# Altium project EPS-LKAS Manipulator.PrjPcb
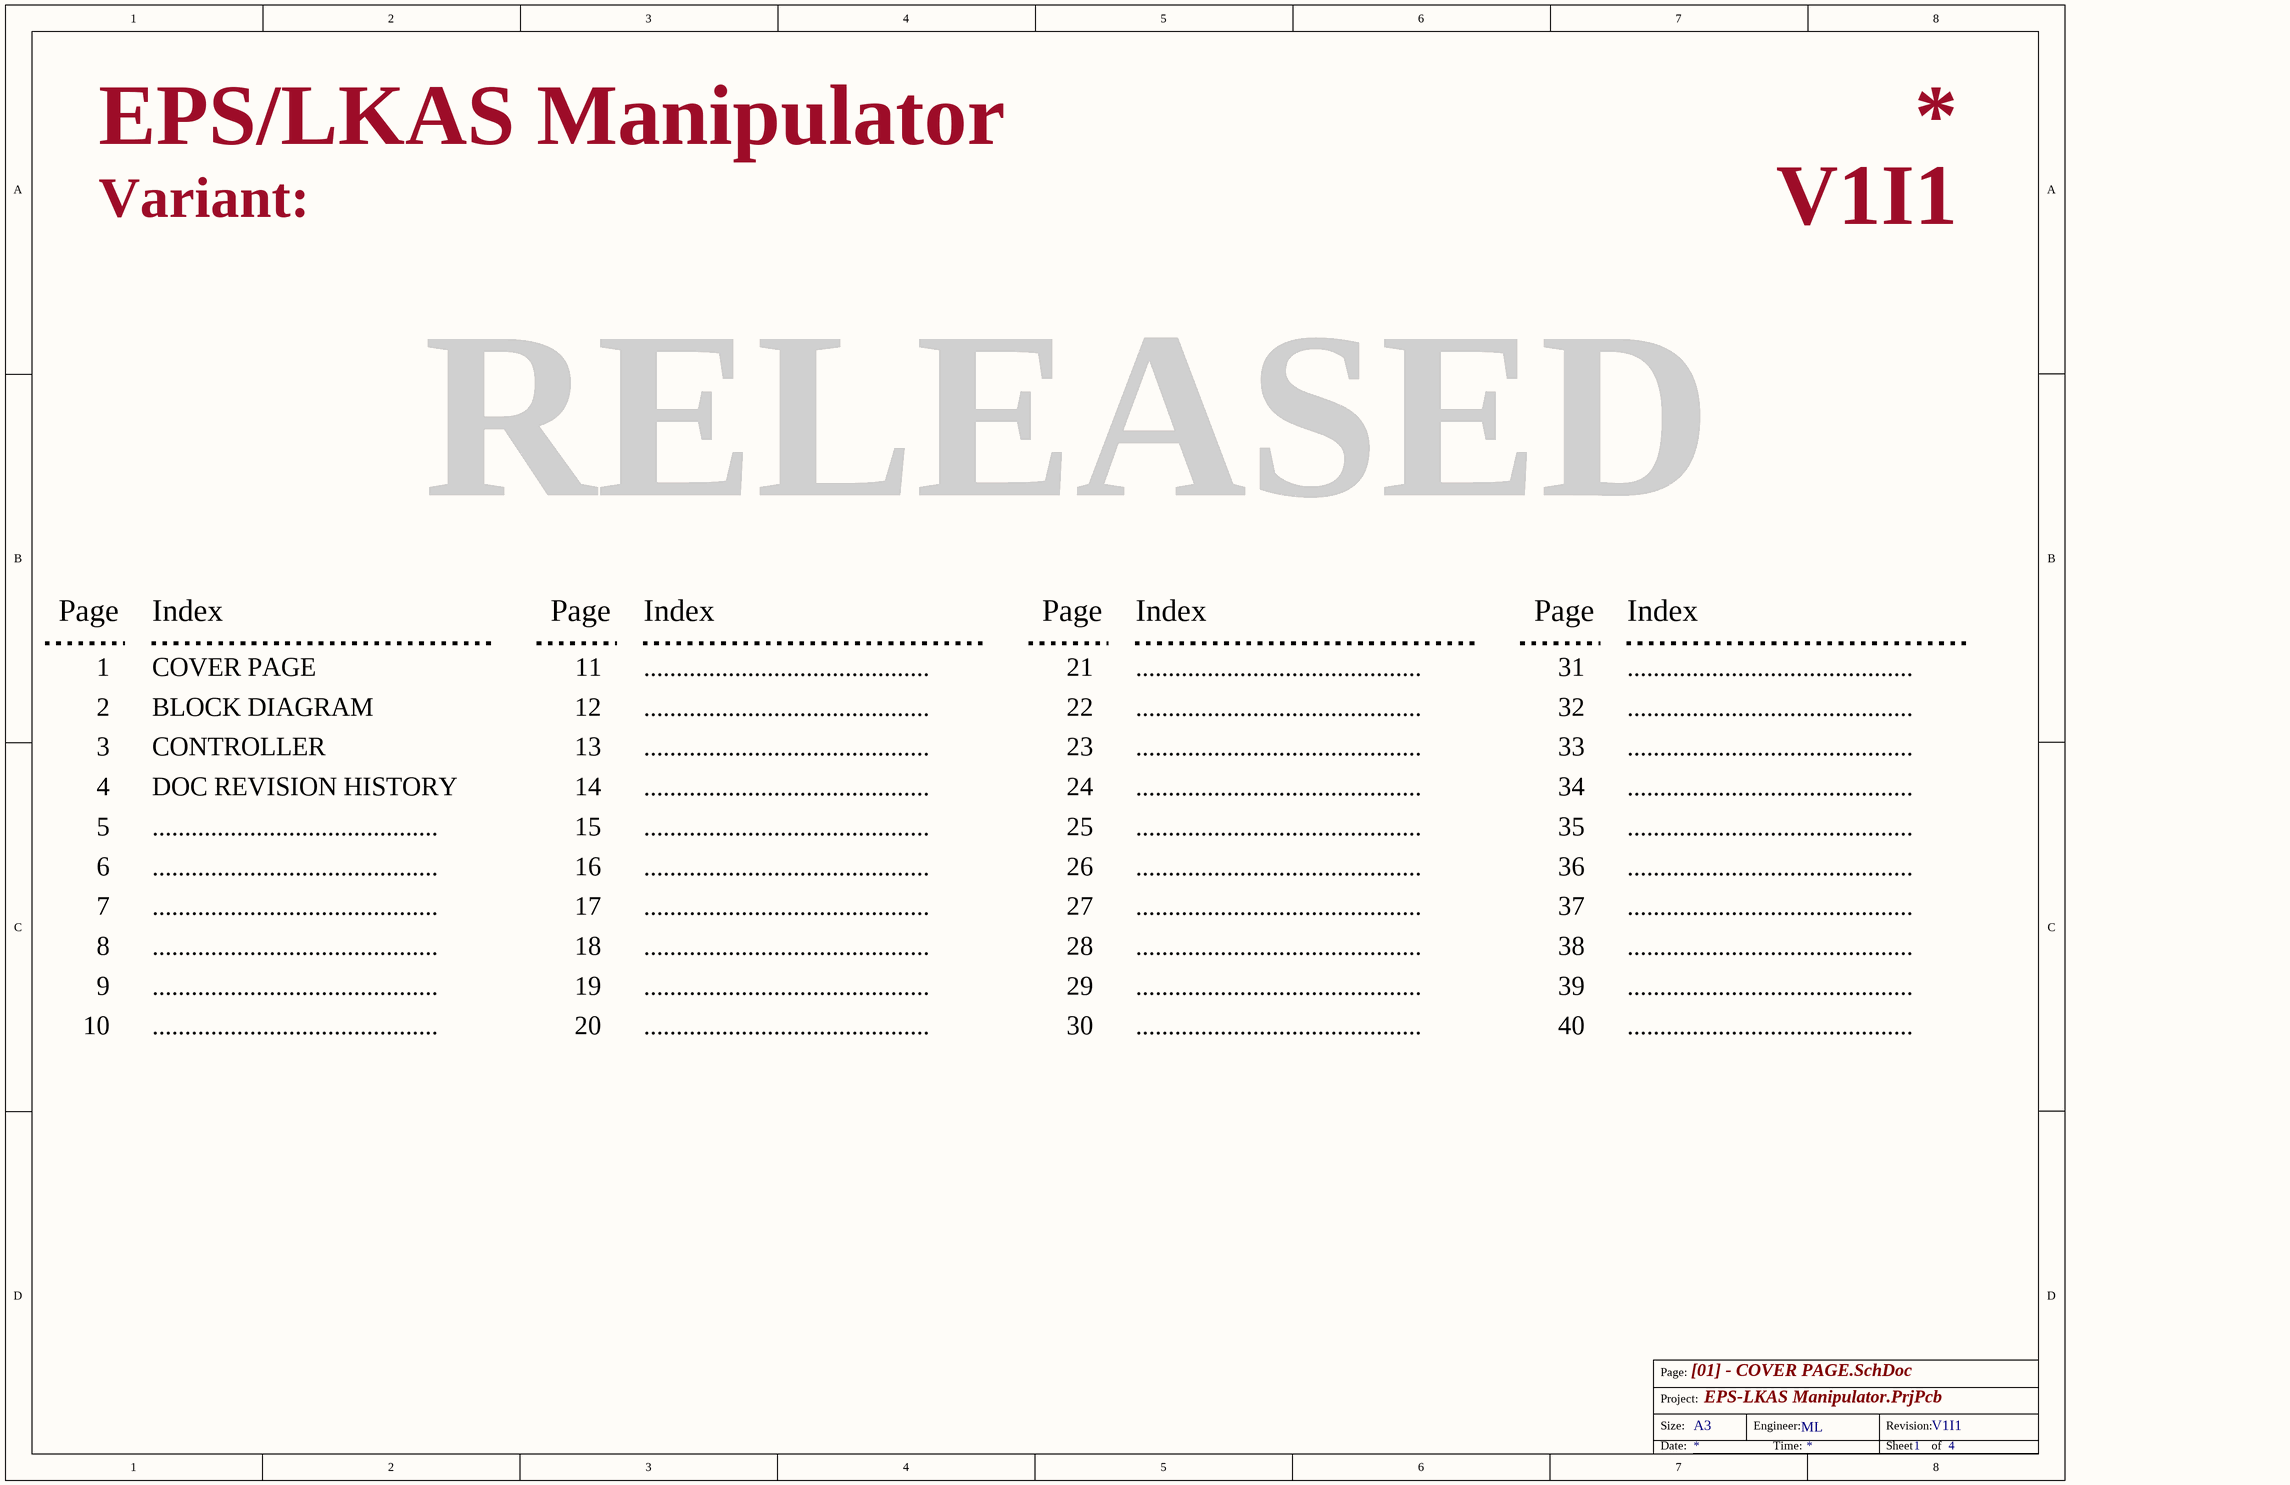
[diagram p0: [01] - COVER PAGE.SchDoc]
Company: Independant; Project: EPS/LKAS Manipulator; VersionRevision: V1I1
4 sheets, 37 parts. Net scope: global (net labels, ports and power ports of the same name join across sheets).
Board file: LKAS-EPS_PCB_V1I1.PcbDoc
Sheets:
  [01] - COVER PAGE.SchDoc
  [02] - BLOCK DIAGRAM.SchDoc
  [03] - CONTROLLER.SchDoc
  [04] - DOC REVISION HISTORY.SchDoc

## Sheet [01] - COVER PAGE.SchDoc
size A3; DocumentNumber: 1; SheetNumber: 1; SheetTotal: 4; Organization: Altium Limited; Address1: L3, 12a Rodborough Rd; Address2: Frenchs Forest; Address3: NSW; Address4: Australia 2086

### Notes on the sheet
- Variant:
- RELEASED
- Page
- Index
- 1
- COVER PAGE
- 11
- ............................................
- 21
- 31
- 2
- 3
- BLOCK DIAGRAM
- CONTROLLER
- 12
- 13
- 22
- 23
- 32
- 33
- 4
- 5
- DOC REVISION HISTORY
- 14
- 15
- 24
- 25
- 34
- 35
- 6
- 16
- 26
- 36
- 7
- 8
- 17
- 18
- 27
- 28
- 37
- 38
- 9
- 10
- 19
- 20
- 29
- 30
- 39
- 40
- Page:
- Size:
- Project:
- A3
- Engineer:
- ML
- Revision:
- Date:
- Time:
- Sheet
- of

## Sheet [02] - BLOCK DIAGRAM.SchDoc
size A3; DocumentNumber: 2; SheetNumber: 2; SheetTotal: 4; Organization: Altium Limited; Address1: L3, 12a Rodborough Rd; Address2: Frenchs Forest; Address3: NSW; Address4: Australia 2086
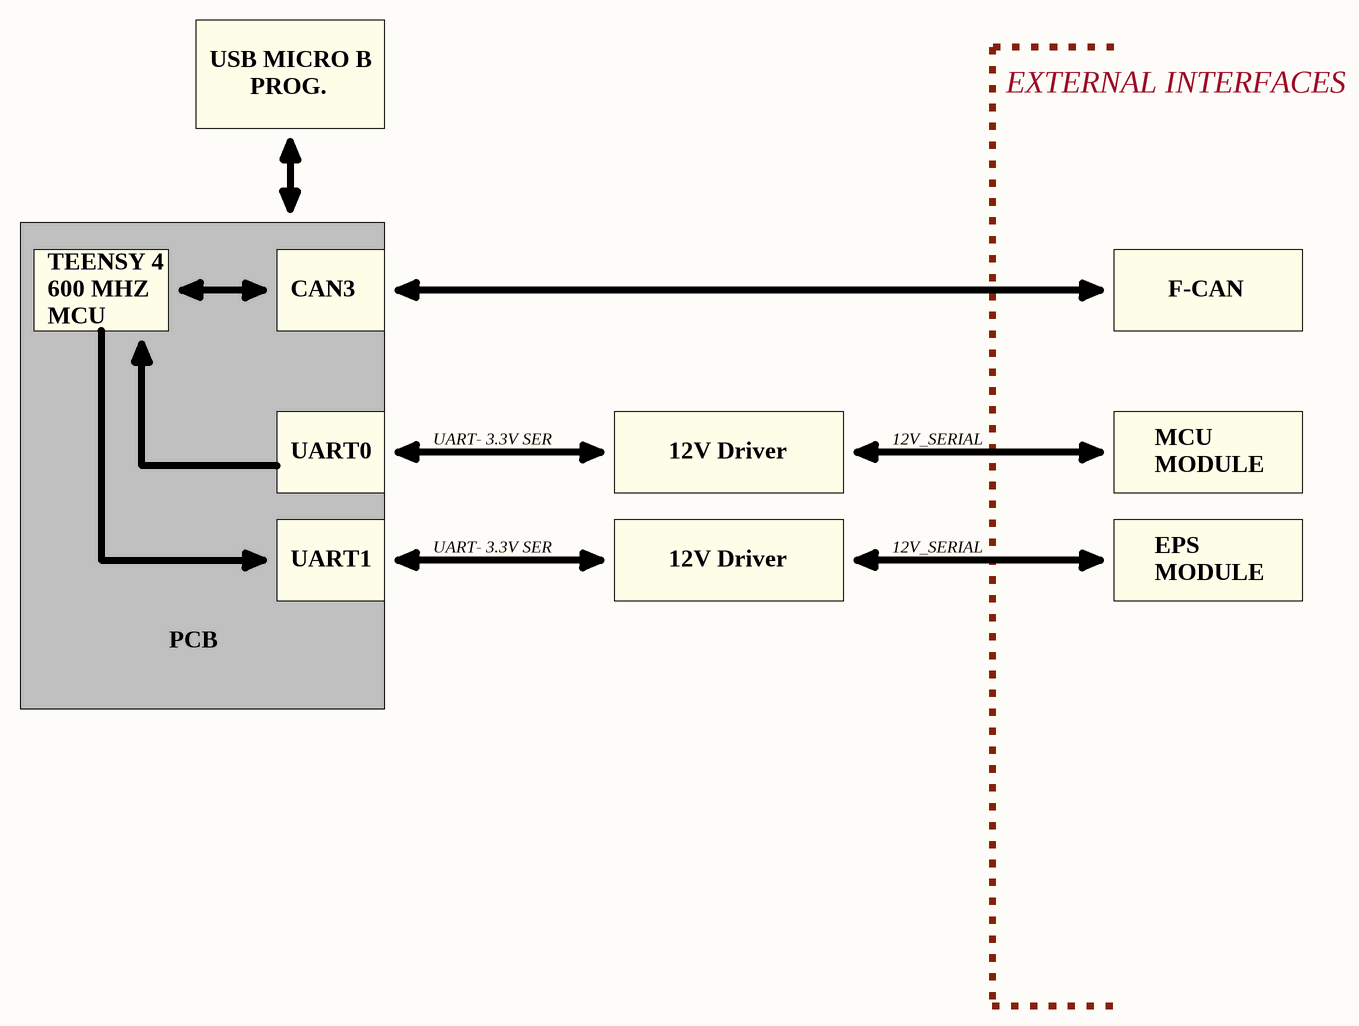
[diagram p1: [02] - BLOCK DIAGRAM.SchDoc]

### Notes on the sheet
- USB MICRO B
- PROG.
- EXTERNAL INTERFACES
- TEENSY 4
- 600 MHZ
- MCU
- CAN3
- F-CAN
- UART0
- UART- 3.3V SER
- 12V Driver
- 12V_SERIAL
- MODULE
- UART1
- Serial
- EPS
- PCB
- Page:
- Size:
- Project:
- A3
- Engineer:
- ML
- Revision:
- Date:
- Time:
- Sheet
- of

## Sheet [03] - CONTROLLER.SchDoc
size A3; DocumentNumber: 3; SheetNumber: 3; SheetTotal: 4; Organization: Altium Limited; Address1: L3, 12a Rodborough Rd; Address2: Frenchs Forest; Address3: NSW; Address4: Australia 2086
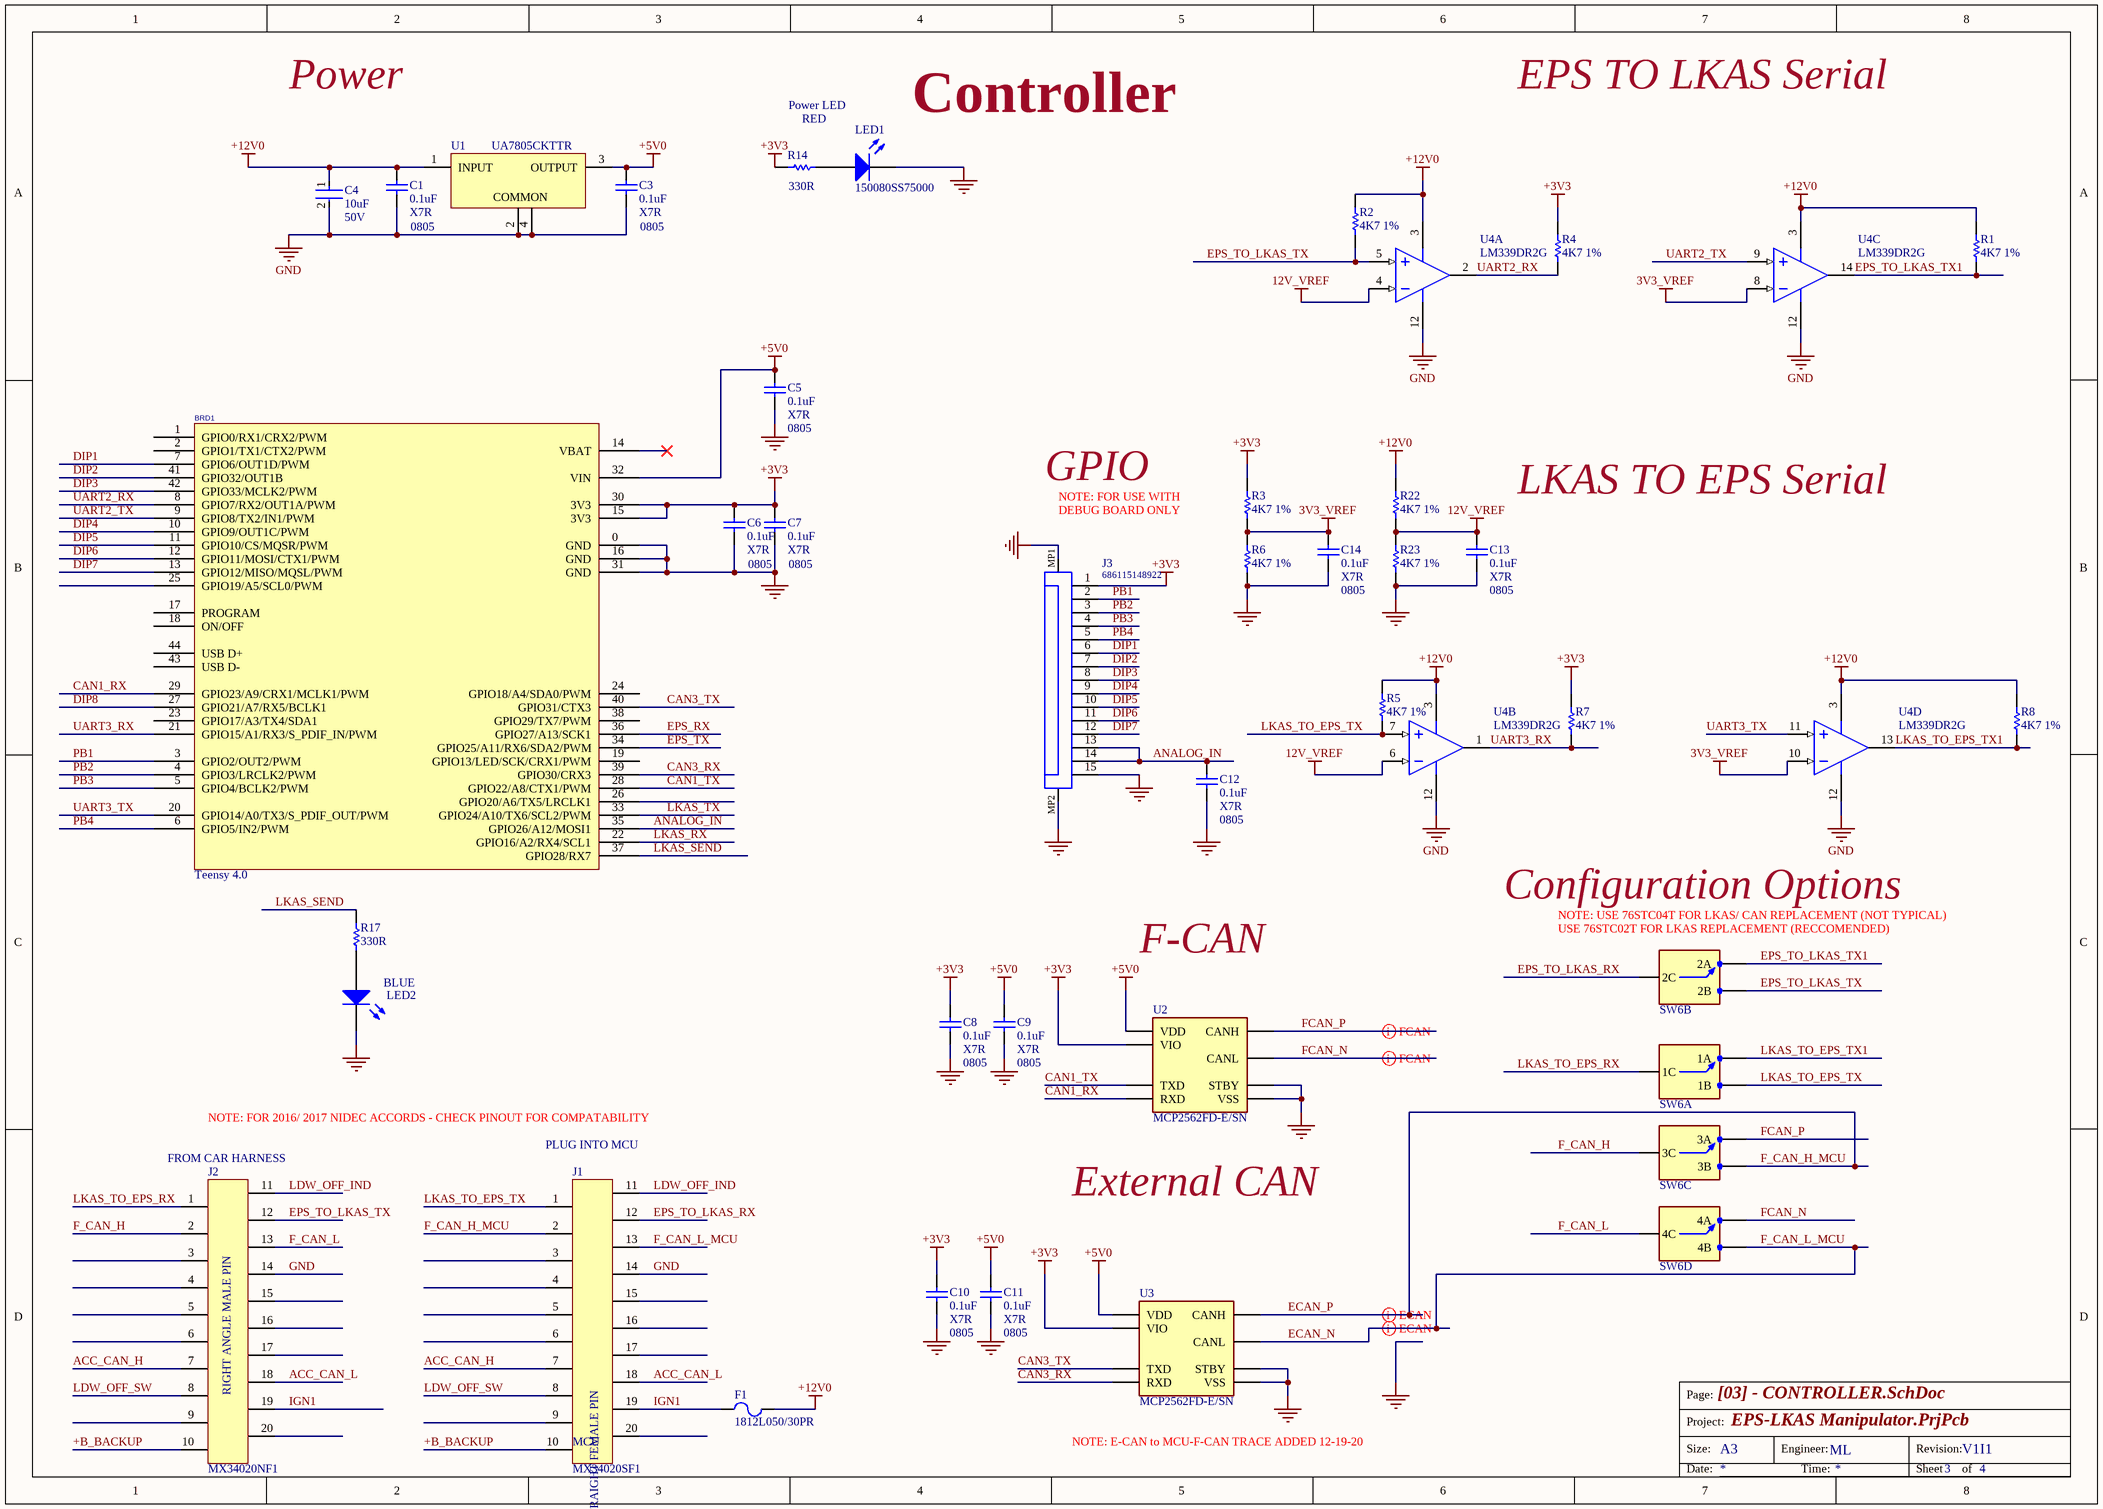
[diagram p2: [03] - CONTROLLER.SchDoc]

### Parts
BRD1  Teensy 4.0  [tEENSY 4.0]
C1  0.1uF  Dielectric: X7R  Case Code (Imperial): 0805  [C0805]
C3  0.1uF  Dielectric: X7R  Case Code (Imperial): 0805  [C0805]
C4  value 10uF  Voltage: 50V  [FP-CL31-IPC_C]  (hidden comment: CL31A106KBHNNNE)
C5  0.1uF  Dielectric: X7R  Case Code (Imperial): 0805  [C0805]
C6  0.1uF  Dielectric: X7R  Case Code (Imperial): 0805  [C0805]
C7  0.1uF  Dielectric: X7R  Case Code (Imperial): 0805  [C0805]
C8  0.1uF  Dielectric: X7R  Case Code (Imperial): 0805  [C0805]
C9  0.1uF  Dielectric: X7R  Case Code (Imperial): 0805  [C0805]
C10  0.1uF  Dielectric: X7R  Case Code (Imperial): 0805  [C0805]
C11  0.1uF  Dielectric: X7R  Case Code (Imperial): 0805  [C0805]
C12  0.1uF  Dielectric: X7R  Case Code (Imperial): 0805  [C0805]
C13  0.1uF  Dielectric: X7R  Case Code (Imperial): 0805  [C0805]
C14  0.1uF  Dielectric: X7R  Case Code (Imperial): 0805  [C0805]
F1  1812L050/30PR  [LFUS-1812L05030PR_V]
J1  MX34020SF1  [MX34020SF1]
J2  MX34020NF1  [MX34020NF1]
J3  686115148922  [686115148922]
LED1  150080SS75000  [0805_A]
LED2  150080BS75000  [0805_A]  (value not drawn)
R1  4K7 1%  [RESC0603(1608)_N]
R2  4K7 1%  [RESC0603(1608)_N]
R3  4K7 1%  [RESC0603(1608)_N]
R4  4K7 1%  [RESC0603(1608)_N]
R5  4K7 1%  [RESC0603(1608)_N]
R6  4K7 1%  [RESC0603(1608)_N]
R7  4K7 1%  [RESC0603(1608)_N]
R8  4K7 1%  [RESC0603(1608)_N]
R14  value 330R  [RESC2013X50X30NL20T20]  (hidden comment: CRCW0805330RFKEA)
R17  value 330R  [RESC2013X50X30NL20T20]  (hidden comment: CRCW0805330RFKEA)
R22  4K7 1%  [RESC0603(1608)_N]
R23  4K7 1%  [RESC0603(1608)_N]
SW6  76STC04T  [76STC04T]  (value not drawn)  (parts A,B,C,D of 4)
U1  UA7805CKTTR  [KTT0003A_V]
U2  MCP2562FD-E/SN  [MCP2561]
U3  MCP2562FD-E/SN  [MCP2561]
U4  LM339DR2G  [ONSC-SOIC-14-751A-03_V]  (parts A,B,C,D of 4)

### Nets
3V3_VREF: C14.2 R3.1 R6.2 U4.8(IN3-) U4.10(IN4-)
12V_VREF: C13.2 R22.1 R23.2 U4.4(IN1-) U4.6(IN2-)
+3V3: BRD1.15(3V3) BRD1.30(3V3) C6.2 C7.2 C8.2 C10.2 J3.1 R3.2 R4.2 R7.2 R14.1 U2.5(VIO) U3.5(VIO)
+5V0: BRD1.32(VIN) C3.2 C5.2 C9.2 C11.2 U1.3(OUTPUT) U2.3(VDD) U3.3(VDD)
+12V0: C1.2 C4.1 F1.2 R1.2 R2.2 R5.2 R8.2 R22.2 U1.1(INPUT) U4.3(VCC)
GND: BRD1.0(GND) BRD1.16(GND) BRD1.31(GND) C1.1 C3.1 C4.2 C5.1 C6.1 C7.1 C8.1 C9.1 C10.1 C11.1 C12.1 C13.1 C14.1 J1.14 J2.14 J3.15 J3.MP1 J3.MP2 LED1.1(K) LED2.1(K) R6.1 R23.1 U1.2(COMMON) U1.4(COMMON) U2.2(VSS) U2.8(STBY) U3.2(VSS) U3.8(STBY) U4.12(GND)
+B_BACKUP: J1.10 J2.10
ACC_CAN_H: J1.7 J2.7
ACC_CAN_L: J1.18 J2.18
ANALOG_IN: BRD1.35(GPIO26/A12/MOSI1) C12.2 J3.13 J3.14
CAN1_RX: BRD1.29(GPIO23/A9/CRX1/MCLK1/PWM) U2.4(RXD)
CAN1_TX: BRD1.28(GPIO22/A8/CTX1/PWM) U2.1(TXD)
CAN3_RX: BRD1.39(GPIO30/CRX3) U3.4(RXD)
CAN3_TX: BRD1.40(GPIO31/CTX3) U3.1(TXD)
DIP1: BRD1.7(GPIO6/OUT1D/PWM) J3.6
DIP2: BRD1.41(GPIO32/OUT1B) J3.7
DIP3: BRD1.42(GPIO33/MCLK2/PWM) J3.8
DIP4: BRD1.10(GPIO9/OUT1C/PWM) J3.9
DIP5: BRD1.11(GPIO10/CS/MQSR/PWM) J3.10
DIP6: BRD1.12(GPIO11/MOSI/CTX1/PWM) J3.11
DIP7: BRD1.13(GPIO12/MISO/MQSL/PWM) J3.12
DIP8: BRD1.27(GPIO21/A7/RX5/BCLK1)
ECAN_N: J1.13 SW6.4B U3.6(CANL)  [also labelled F_CAN_L_MCU]
ECAN_P: J1.2 SW6.3B U3.7(CANH)  [also labelled F_CAN_H_MCU]
EPS_RX: BRD1.36(GPIO27/A13/SCK1)
EPS_TO_LKAS_RX: J1.12 SW6.C2(2C)
EPS_TO_LKAS_TX: J2.12 R2.1 SW6.2B U4.5(IN1+)
EPS_TO_LKAS_TX1: R1.1 SW6.2A U4.14(OUT3)
EPS_TX: BRD1.34(GPIO25/A11/RX6/SDA2/PWM)
F_CAN_H: J2.2 SW6.C3(3C)
F_CAN_L: J2.13 SW6.C4(4C)
FCAN_N: SW6.4A U2.6(CANL)
FCAN_P: SW6.3A U2.7(CANH)
IGN1: F1.1 J1.19 J2.19
LDW_OFF_IND: J1.11 J2.11
LDW_OFF_SW: J1.8 J2.8
LKAS_RX: BRD1.22(GPIO16/A2/RX4/SCL1)
LKAS_SEND: BRD1.37(GPIO28/RX7) R17.2
LKAS_TO_EPS_RX: J2.1 SW6.C1(1C)
LKAS_TO_EPS_TX: J1.1 R5.1 SW6.1B U4.7(IN2+)
LKAS_TO_EPS_TX1: R8.1 SW6.1A U4.13(OUT4)
LKAS_TX: BRD1.33(GPIO24/A10/TX6/SCL2/PWM)
PB1: BRD1.3(GPIO2/OUT2/PWM) J3.2
PB2: BRD1.4(GPIO3/LRCLK2/PWM) J3.3
PB3: BRD1.5(GPIO4/BCLK2/PWM) J3.4
PB4: BRD1.6(GPIO5/IN2/PWM) J3.5
UART2_RX: BRD1.8(GPIO7/RX2/OUT1A/PWM) R4.1 U4.2(OUT1)
UART2_TX: BRD1.9(GPIO8/TX2/IN1/PWM) U4.9(IN3+)
UART3_RX: BRD1.21(GPIO15/A1/RX3/S_PDIF_IN/PWM) R7.1 U4.1(OUT2)
UART3_TX: BRD1.20(GPIO14/A0/TX3/S_PDIF_OUT/PWM) U4.11(IN4+)
NetLED1_2: LED1.2(A) R14.2
NetLED2_2: LED2.2(A) R17.1

Not connected (* = marked no-connect by the designer): BRD1 1(GPIO0/RX1/CRX2/PWM) 2(GPIO1/TX1/CTX2/PWM) 14(VBAT)* 17(PROGRAM) 18(ON/OFF) 19(GPIO13/LED/SCK/CRX1/PWM) 23(GPIO17/A3/TX4/SDA1) 24(GPIO18/A4/SDA0/PWM) 25(GPIO19/A5/SCL0/PWM) 26(GPIO20/A6/TX5/LRCLK1) 38(GPIO29/TX7/PWM) 43(USB_D-) 44(USB_D+); J1 3 4 5 6 9 15 16 17 20; J2 3 4 5 6 9 15 16 17 20

### Layout directives
differential pair: ECAN_N, ECAN_P, FCAN_N, FCAN_P

### Notes on the sheet
- Power
- Power LED
- EPS TO LKAS Serial
- RED
- (near LED1) Controller
- GPIO
- NOTE: FOR USE WITH
- DEBUG BOARD ONLY
- LKAS TO EPS Serial
- Configuration Options
- (near SW6) NOTE: USE 76STC04T FOR LKAS/ CAN REPLACEMENT (NOT TYPICAL)
- BLUE
- F-CAN
- (near SW6) USE 76STC02T FOR LKAS REPLACEMENT (RECCOMENDED)
- NOTE: FOR 2016/ 2017 NIDEC ACCORDS - CHECK PINOUT FOR COMPATABILITY
- (near J2) FROM CAR HARNESS
- (near J1) PLUG INTO MCU
- External CAN
- (near J1) MCU
- NOTE: E-CAN to MCU-F-CAN TRACE ADDED 12-19-20
- Page:
- Size:
- Project:
- A3
- Engineer:
- ML
- Revision:
- Date:
- Time:
- Sheet
- of
- (in symbol MX34020NF1) RIGHT ANGLE MALE PIN
- (in symbol MX34020SF1) STRAIGHT FEMALE PIN

### Library data of the parts
C1 C3 C5-C14 = CL21B104KCFWPNE: CAP CER 0.1UF 100V X7R 0805; Manufacturer: Samsung; Capacitance: 100nF; Tolerance: 10%; Supplier 1: Digi-Key; Manufacturer Part Number: CL21B104KCFWPNE; Stock 1: 283289; Pricing 1: 1=0.16000, 10=0.11200, 100=0.05250, 500=0.03684, 1000=0.03050 (USD); RoHS: Yes; Mount: Surface Mount; Case/Package: 0805; Case Code (Metric): 2012; Min Operating Temperature: -55°C; Max Operating Temperature: 125°C; Packaging: Tape and Reel; Features: Soft Termination; Length: 0.079inch; Width: 0.049inch; Thickness: 0.053inch; Ratings: AEC-Q200; ComponentLink1URL: http://www.samsungsem.com/servlet/FileDownload?type=spec&file=CL21B104KCFWPNE.pdf&src-supplier=Avnet; ComponentLink1Description: http://www.samsungsem.com/servlet/FileDownload?type=spec&file=CL21B104KCFWPNE.pdf&src-supplier=Avnet; ComponentLink2URL: http://www.samsungsem.com/kr/support/product-search/mlcc/CL21B104KCFWPNE.jsp?src-supplier=Digi-Key; ComponentLink2Description: http://www.samsungsem.com/kr/support/product-search/mlcc/CL21B104KCFWPNE.jsp?src-supplier=Digi-Key; Supplier Part Number 1: 1276-6733-1-ND; Voltage Rating: 100V
C4 = CMP-13271-000016-1: CAP CER 10UF 50V X5R 1206; Manufacturer: Samsung; Tolerance: 10%; Material: Ceramic; Temperature Coefficient: 15%; RoHS: TRUE; Ipc Land Pattern Name: CAPC320160X160; Temperature Range Low: -55°C; Device Class L3: Ceramic Capacitors; Category: Cap; Temperature Characteristic: X5R; Lead Free: Yes; Device Class L2: Capacitors; Octopart: https://octopart.com/cl31a106kbhnnne-samsung-19832778; ComponentLink2Description: Datasheet; Digikey Description: CAP CER 10UF 50V X5R 1206; ComponentLink2URL: http://www.samsungsem.com/kr/support/product-search/mlcc/__icsFiles/afieldfile/2018/06/21/CL31A106KBHNNNE.pdf; Capacitance: 10uF; Manufacturer Part Number: CL31A106KBHNNNE; Temperature Range High: +85°C; Device Class L1: Passive Components; Height: 1.8mm; Automotive: No; Voltage Rating: 50V; Package: CL31; Temperature: -55°C to +85°C
F1 = CMP-2000-05508-1: PTC Resettable Fuse, 0.8 W, 30 V, -40 to 85 degC, 2-Pin SMD, RoHS, Tape and Reel; Manufacturer: Littelfuse-Inc.; Voltage - Max: 30V; Current - Hold (Ih) (Max): 500mA; Time to Trip: 0.15s; Current - Max: 100A; R Min/Max: 0.150~1.000Ohm; Current - Trip (It): 1A; Package Reference: 1812; Family: PTCResettableFuses; Packaging: Tape&Reel(TR); Package / Case: 1812(4532Metric),Concave; Series: POLY-FUSE®,1812L; Mounting Technology: SurfaceMount; Datasheet Version: 02/2016; Datasheet URL: http://www.littelfuse.com/~/media/electronics/datasheets/resettable_ptcs/littelfuse_ptc_1812l_datasheet.pdf.pdf; Manufacturer URL: http://www.littelfuse.com/; Category: CircuitProtection; Package Description: 2-Pin Surface Mount Device, Body 4.55 x 3.24 mm
J1 = MX34020SF1: Automotive Connectors Sckt HOUSING 20P; Manufacturer: JAE Electronics; Number of Positions: 20; Connector Type: Receptacle,Socket,Rectangular; Gender: Female; Current Rating: 3A; Pitch: 0.087inch; Row Spacing: 0.118inch; Supplier 1: Digi-Key; Manufacturer Part Number: MX34020SF1; RoHS: Yes; Category: Connectors; Stock 1: 3393; Pricing 1: 1=0.73000, 10=0.63800, 25=0.60000, 50=0.57500, 100=0.55000, 250=0.50000, 576=0.45000, 1152=0.40000, 2880=0.36250 (USD); Mount: Free Hanging,Cable; Color: Grey; Contact Plating: Tin; Contact Material: Copper Alloy,Copper; Housing Material: PPE; Min Operating Temperature: -40°C; Max Operating Temperature: 85°C; Termination: Crimp; Packaging: Tray; Package Quantity: 192; Number of Contacts: 20; Number of Rows: 2; Height: 14mm; Depth: 21.3mm; Width: 25.1mm; ComponentLink1URL: https://datasheet.ciiva.com/11742/0900766b80fc15d5-11742077.pdf?src-supplier=RSComponents; ComponentLink1Description: https://datasheet.ciiva.com/11742/0900766b80fc15d5-11742077.pdf?src-supplier=RSComponents; ComponentLink2URL: https://datasheet.ciiva.com/4553/sj038752-64597-4553699.pdf?src-supplier=Mouser; ComponentLink2Description: https://datasheet.ciiva.com/4553/sj038752-64597-4553699.pdf?src-supplier=Mouser; ComponentLink3URL: https://datasheet.ciiva.com/6739/614004-6739335.pdf?src-supplier=Newark; ComponentLink3Description: https://datasheet.ciiva.com/6739/614004-6739335.pdf?src-supplier=Newark; ComponentLink4URL: https://datasheet.ciiva.com/762/transportation-pg-v2-2-762885.pdf?src-supplier=Digi-Key; ComponentLink4Description: https://datasheet.ciiva.com/762/transportation-pg-v2-2-762885.pdf?src-supplier=Digi-Key; ComponentLink5URL: https://datasheet.ciiva.com/5821/1009688-5821398.pdf?src-supplier=Farnell; ComponentLink5Description: https://datasheet.ciiva.com/5821/1009688-5821398.pdf?src-supplier=Farnell; ComponentLink6URL: https://datasheet.ciiva.com/7648/1009712-7648886.pdf?src-supplier=Element14; ComponentLink6Description: https://datasheet.ciiva.com/7648/1009712-7648886.pdf?src-supplier=Element14; Supplier Part Number 1: 670-2925-ND
J2 = MX34020NF1: JAE MX34 Series, 2.2mm Pitch 20 Way 2 Row Right Angle PCB Header, Solder Termination, 3A; Manufacturer: JAE Electronics; Connector Type: Male Pin,Rectangular; Gender: Male; Number of Positions: 20; Pitch: 0.087inch; Row Spacing: 0.118inch; Supplier 1: Digi-Key; Manufacturer Part Number: MX34020NF1; RoHS: Yes; Category: Connectors; Stock 1: 10297; Pricing 1: 1=1.57000, 10=1.42100, 100=1.21800, 500=1.01500, 1000=0.87000, 5000=0.77140, 10000=0.75400 (USD); Mount: Through Hole; Contact Material: Brass; Contact Plating: Tin; Color: Grey; Number of Rows: 2; Package Quantity: 288; Packaging: Rail/Tube; Current Rating: 3A; Termination: Solder; Orientation: Right Angle; Number of Contacts: 20; Contact Mating Length: 0.303inch; REACH SVHC: No SVHC; ComponentLink1URL: https://datasheet.ciiva.com/7621/1009688-7621584.pdf?src-supplier=Element14; ComponentLink1Description: https://datasheet.ciiva.com/7621/1009688-7621584.pdf?src-supplier=Element14; ComponentLink2URL: https://datasheet.ciiva.com/4554/sj038751-3818-4554108.pdf?src-supplier=Mouser; ComponentLink2Description: https://datasheet.ciiva.com/4554/sj038751-3818-4554108.pdf?src-supplier=Mouser; ComponentLink3URL: https://datasheet.ciiva.com/11754/0900766b80ddc6f0-11754159.pdf?src-supplier=RSComponents; ComponentLink3Description: https://datasheet.ciiva.com/11754/0900766b80ddc6f0-11754159.pdf?src-supplier=RSComponents; ComponentLink4URL: https://datasheet.ciiva.com/732/transportation-pg-v2-2-732931.pdf?src-supplier=Digi-Key; ComponentLink4Description: https://datasheet.ciiva.com/732/transportation-pg-v2-2-732931.pdf?src-supplier=Digi-Key; Supplier Part Number 1: 670-2924-ND
J3 = CMP-1502-01518-1: SMT ZIF Connectors Hinge Type WR-FPC, Horizontal, Bottom Contact, pitch 1 mm, 15 pins; Manufacturer: Wurth Elektronik; Withstanding Voltage: 500VAC; Contact Resistance: 50mOhm; Pitch: 1mm; Rated Current: 1A; Working Voltage: 100VAC; Pin Number: 15; Publisher: WurthElektronik; Part Number: 686115148922; Packaging: TapeandReel; Operating Temperature: -40to105degC; Contact Design: BottomContact; Manufacturer URL: http://www.we-online.de; Mounting Technology: SMT; Orientation: Horizontal; Package Reference: 686115148922; Datasheet URL: https://katalog.we-online.de/em/datasheet/686115148922.pdf
LED1 = CMP-1426-00010-1: SMD mono-color Chip LED, WL-SMCW, Super Red; Manufacturer: Wuerth Elektronik; PackageReference: 0805_A; ComponentLink2URL: http://katalog.we-online.com/led/datasheet/150080SS75000.pdf; ComponentLink1URL: http://www.we-online.com; Color: Super Red; ComponentLink2Description: Datasheet; ComponentLink1Description: Manufacturer URL; PartNumber: 150080SS75000
LED2 = CMP-1426-00008-1: SMD mono-color Chip LED, WL-SMCW, Blue; Manufacturer: Wuerth Elektronik; Color: Blue; ComponentLink2URL: http://katalog.we-online.com/led/datasheet/150080BS75000.pdf; ComponentLink1URL: http://www.we-online.com; ComponentLink2Description: Datasheet; PackageReference: 0805_A; ComponentLink1Description: Manufacturer URL; PartNumber: 150080BS75000
R1-R8 R22 R23 = CMP-1012-00586-1: 4K7 0.1W 1% 0603 (1608 Metric)  SMD; Case-EIA: 0603; Case-Metric: 1608; Value: 4700.00 Ohm; Power: 0.1 W; Tolerance: 1 %; Technology: SMT
R14 R17 = CMP-2001-03823-1: Manufacturer: Vishay Dale; Part Number: CRCW0805330RFKEA
SW6 = 76STC04T: SWITCH TOGGLE DIP SPDT 150MA 30V / WIRED: / 1  2  3  4   5   6 / 7  8  9  10 11 12; Manufacturer: Grayhill; Body Material: Thermoplastic; Mechanical Life: 2000Cycles; Number of Positions: 4; Actuator Length: 5.08mm; Pitch: 0.1inch; Washable: No; Supplier 1: Digi-Key; Manufacturer Part Number: 76STC04T; RoHS: Yes; Category: DIP Switches; Stock 1: 149; Pricing 1: 1=4.74000, 10=4.54200, 25=4.14720, 100=3.59410, 250=3.25836, 500=3.02140, 1000=2.80417, 2500=2.54745, 5000=2.36972 (USD); Mount: Through Hole,PCB; Contact Material: Copper Alloy,Gold; Contact Plating: Gold; Min Operating Temperature: -40°C; Max Operating Temperature: 85°C; Throw Configuration: SPDT; Max Voltage Rating (DC): 30V; Termination: PC Pins; Packaging: Rail/Tube; Voltage Rating (DC): 30V; Max Current Rating: 150mA; Package Quantity: 13; Current Rating: 150mA; Electrical Life: 2000Cycles; Number of Circuits: 4; Contact Current Rating: 150mA; Voltage Rating: 30V; Actuator Type: Toggle; Orientation: Straight; Length: 0.78inch; Depth: 9.65mm; Radiation Hardening: No; REACH SVHC: No SVHC; Lead Free: Lead Free; ComponentLink1URL: https://datasheet.ciiva.com/16198/dip-series-76-and-78-spdt-16198550.pdf?src-supplier=Onlinecomponents.com; ComponentLink1Description: https://datasheet.ciiva.com/16198/dip-series-76-and-78-spdt-16198550.pdf?src-supplier=Onlinecomponents.com; ComponentLink2URL: https://datasheet.ciiva.com/2865/dip-series-76-and-78-spdt-2865964.pdf?src-supplier=Digi-Key; ComponentLink2Description: https://datasheet.ciiva.com/2865/dip-series-76-and-78-spdt-2865964.pdf?src-supplier=Digi-Key; Supplier Part Number 1: GH7721-ND
U1 = CMP-1685-00014-1: Fixed Positive Voltage Regulator, 7 to 25 V, 1.5 A, 0 to 125 degC, 3-Pin DDPAK (KTT), Green (RoHS / & no Sb/Br), Tape and Reel; Tolerance: 1%; Resistance: 220 Ohm; Case\Package: 0603; Voltage Rating: 50 V; Power Rating: 100 mW; Package Quantity: 5000; Min Operating Temperature: -55 degC; ComponentLink2Description: Datasheet; ComponentLink1Description: Manufacturer URL; RoHSCompliant: true; Mount: Surface Mount; PackageDescription: 3-Pin Surface Mount Device, Body 10.16 x 9.015 mm, Pitch 2.54 mm; Width: 0.8 mm; Max Operating Temperature: 155 degC; Pins: 2; ComponentLink1URL: http://www.ti.com/; Case Code (Metric): 1608; Packaging: Tape and Reel; Case Code (Imperial): 0603; Height: 0.45 mm; Code_JEDEC: TO-263; DatasheetVersion: SLVS056P, 01/2015; Length: 1.6 mm; REACH SVHC: No SVHC; ComponentLink2URL: http://www.ti.com/lit/ds/symlink/ua7805.pdf; PackageReference: KTT0003A; Voltage Rating (DC): 50 V
U2 U3 = MCP2562FD-E/SN: 8 SOIC 3.90mm(.150in) TUBECAN Flexible Data Rate Transceiver; Manufacturer: Microchip; Supplier 1: Digi-Key; Manufacturer Part Number: MCP2562FD-E/SN; RoHS: Yes; Category: Interface ICs; Stock 1: 1433; Pricing 1: 1=0.96000, 25=0.80000, 100=0.73000 (USD); ComponentLink1URL: https://datasheet.ciiva.com/46406/1821190-46406053.pdf?src-supplier=Element14; ComponentLink1Description: https://datasheet.ciiva.com/46406/1821190-46406053.pdf?src-supplier=Element14; ComponentLink2URL: https://datasheet.ciiva.com/48512/mcp2562fd-e-mf-eng-tds-48512074.pdf?src-supplier=Distrelec; ComponentLink2Description: https://datasheet.ciiva.com/48512/mcp2562fd-e-mf-eng-tds-48512074.pdf?src-supplier=Distrelec; ComponentLink3URL: https://datasheet.ciiva.com/48473/20005284a-48473180.pdf?src-supplier=Avnet; ComponentLink3Description: https://datasheet.ciiva.com/48473/20005284a-48473180.pdf?src-supplier=Avnet; ComponentLink4URL: https://datasheet.ciiva.com/46406/1821190-46406061.pdf?src-supplier=Element14; ComponentLink4Description: https://datasheet.ciiva.com/46406/1821190-46406061.pdf?src-supplier=Element14; Supplier Part Number 1: MCP2562FD-E/SN-ND
U4 = CMP-1305-00036-1: Single Supply Quad Comparators, 0 to 70 degC, 14-Pin SOIC, Pb-Free, Tape and Reel; Manufacturer: On Semiconductor; IO Typ (mA): 16; ComponentLink3URL: http://www.onsemi.com/pub_link/Collateral/751A-03.PDF; RoHS: TRUE; Packing: Tape and Reel; ComponentLink2Description: Datasheet; ComponentLink2URL: http://www.onsemi.com/pub_link/Collateral/LM339-D.PDF; ComponentLink1Description: Manufacturer URL; PackageVersion: Rev. K, 05/2011; DatasheetVersion: Rev. 20; PackageReference: SOIC-14-751A-03; ComponentLink1URL: http://www.onsemi.com/; PartNumber: LM339DR2G; PackageDescription: 14-Pin Small Outline Integrated Circuit, Body 8.65 x 3.9 mm, Pitch 1.27 mm; ComponentLink3Description: Package Specification; Mounting Technology: Surface Mount

## Sheet [04] - DOC REVISION HISTORY.SchDoc
size A3; DocumentNumber: 4; SheetNumber: 4; SheetTotal: 4; Organization: Altium Limited; Address1: L3, 12a Rodborough Rd; Address2: Frenchs Forest; Address3: NSW; Address4: Australia 2086
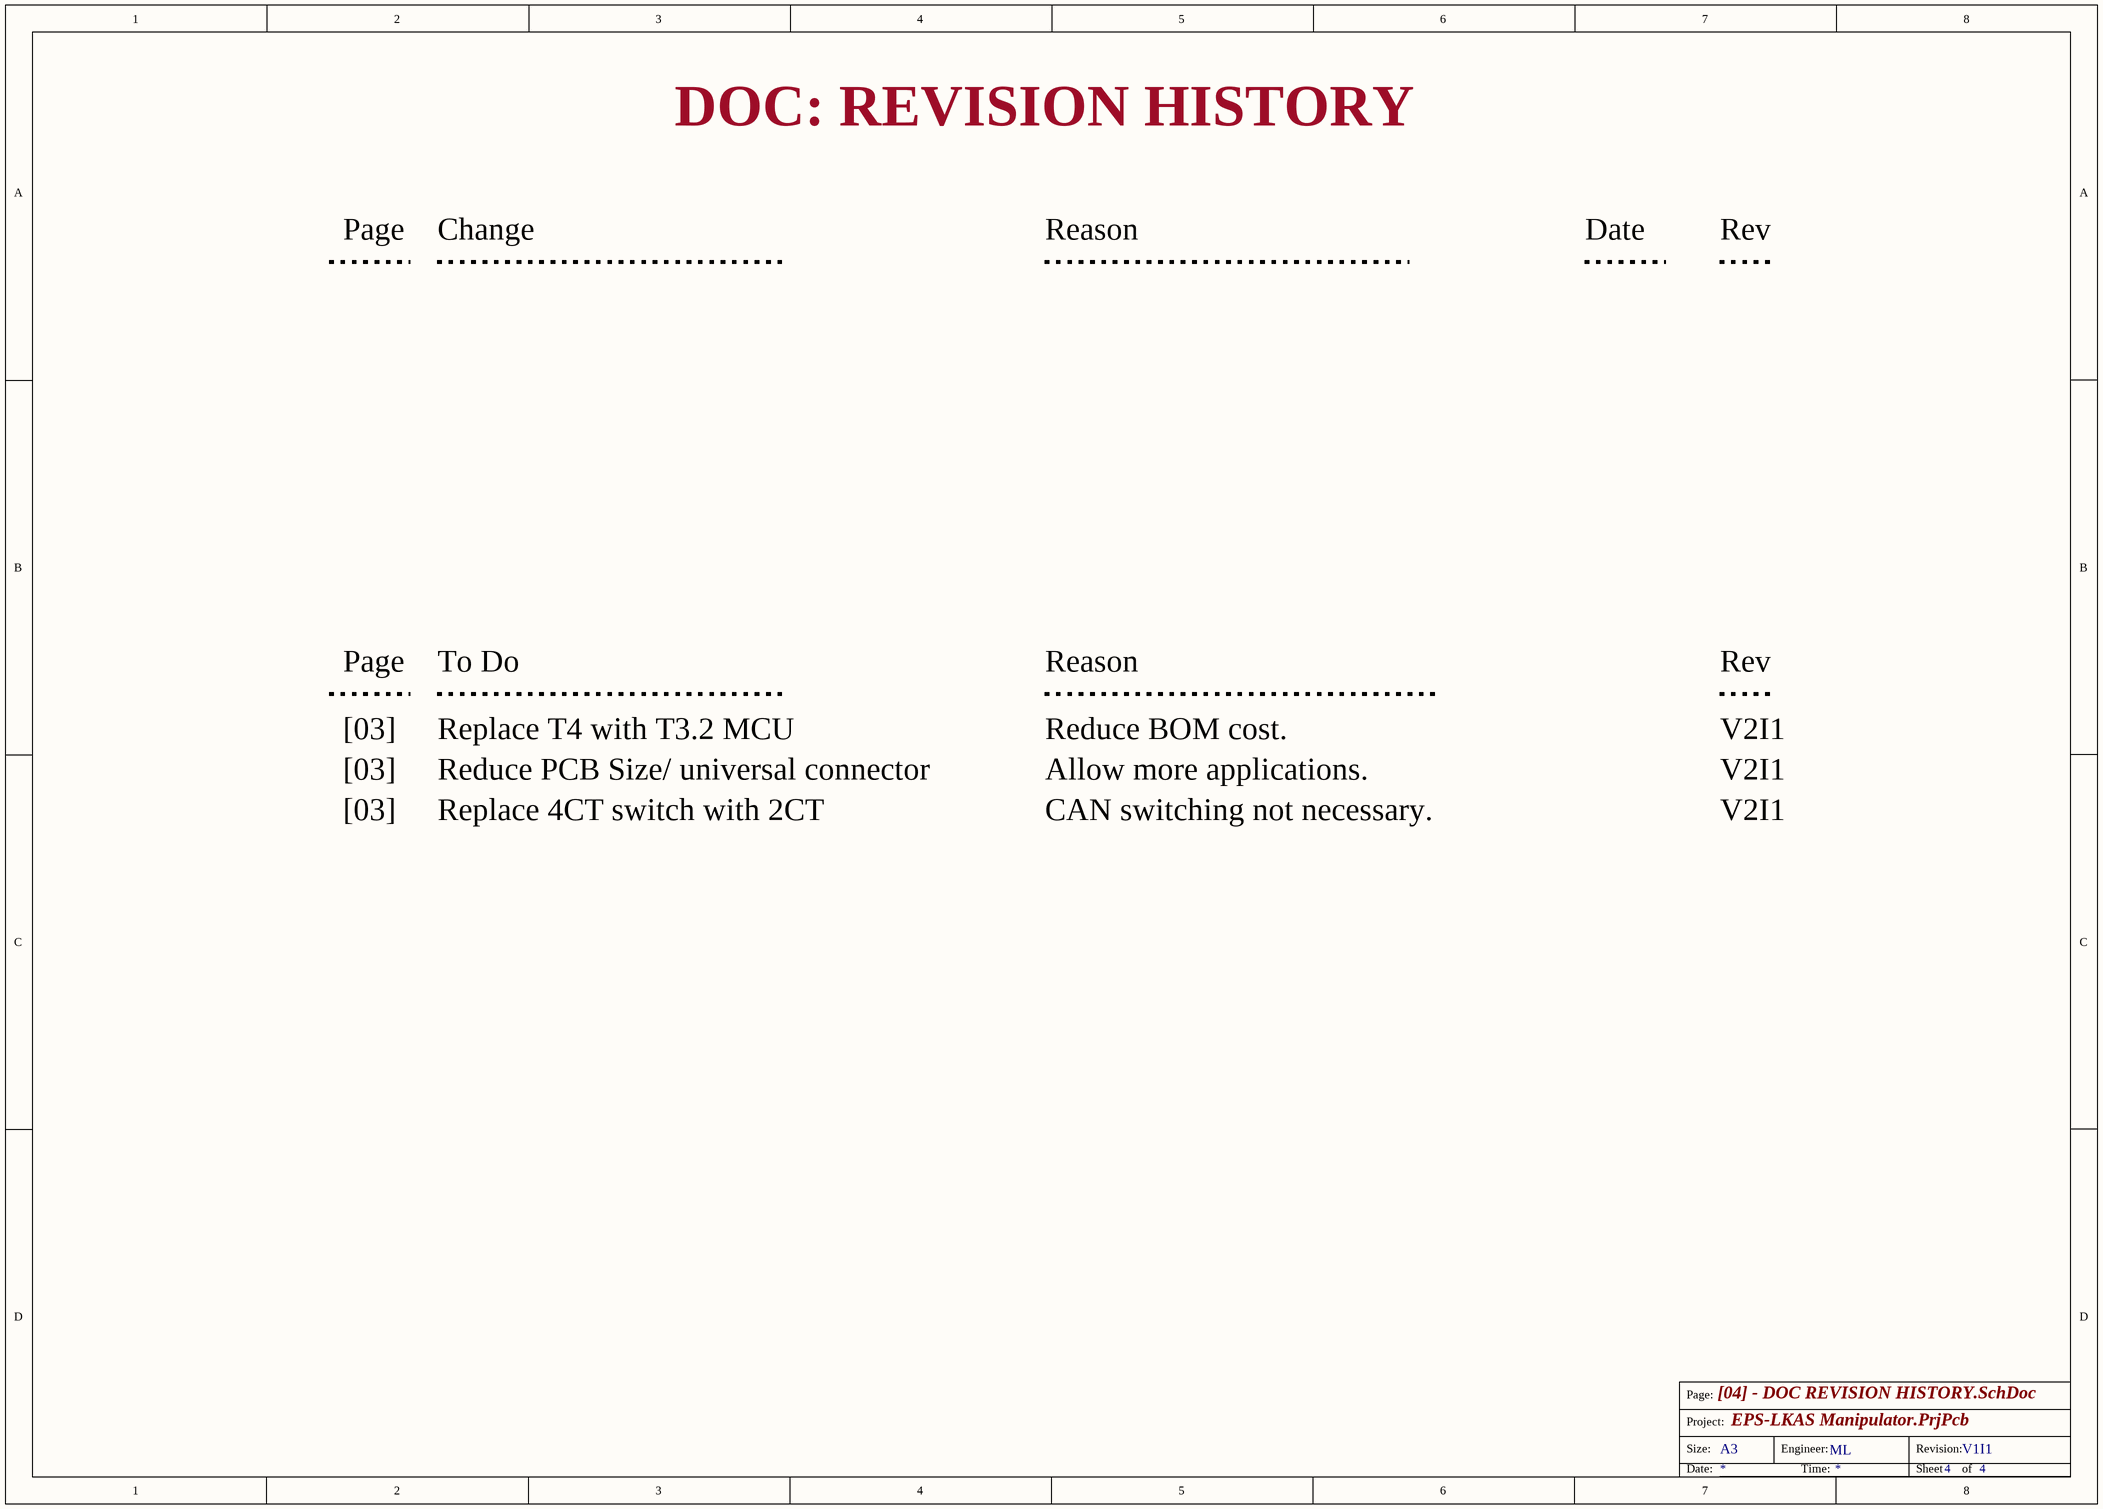
[diagram p3: [04] - DOC REVISION HISTORY.SchDoc]

### Notes on the sheet
- DOC: REVISION HISTORY
- Page
- Change
- Reason
- Date
- Rev
- To Do
- [03]
- Replace T4 with T3.2 MCU
- Reduce PCB Size/ universal connector
- Reduce BOM cost.
- Allow more applications.
- V2I1
- Replace 4CT switch with 2CT
- CAN switching not necessary.
- CLOCKS (CPU & PCIE)
- Page:
- Size:
- Project:
- A3
- Engineer:
- ML
- Revision:
- Date:
- Time:
- Sheet
- of